# Altium schematic sheet NEO-M9N.SchDoc
size A4; SheetNumber: 6; SheetTotal: 10
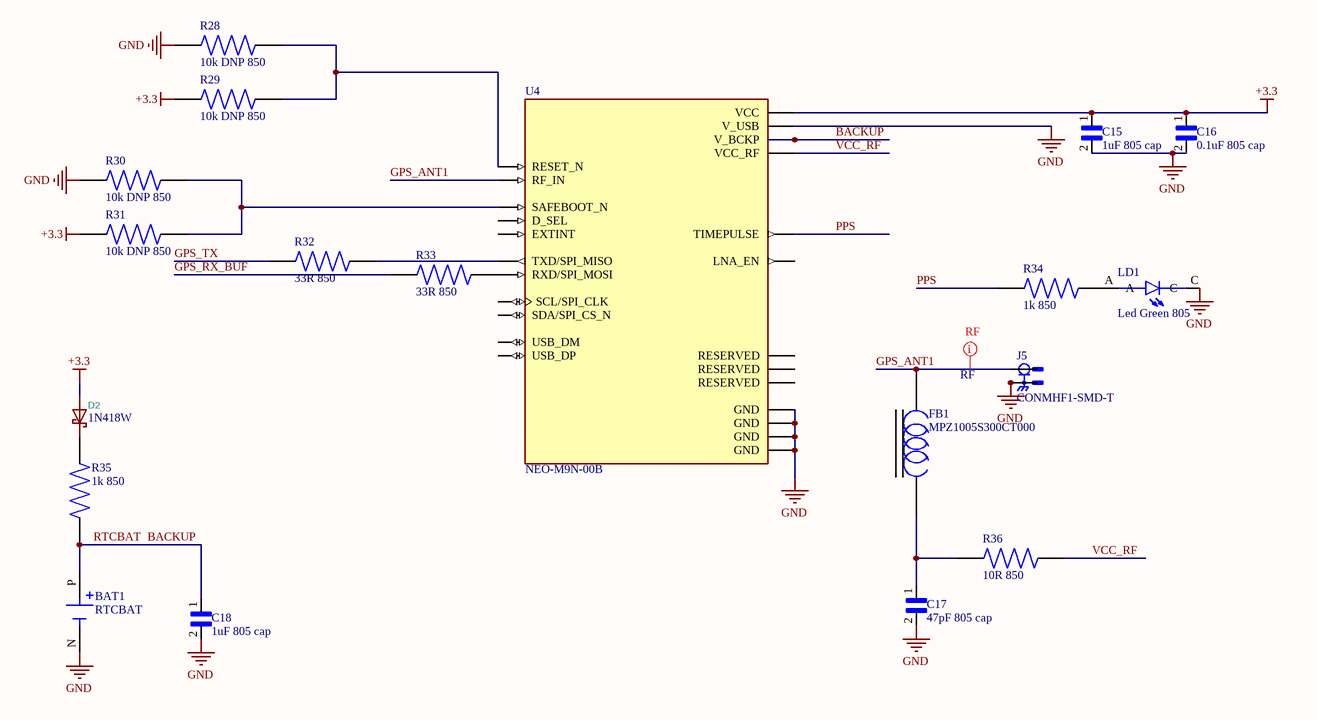
[diagram p0: NEO-M9N.SchDoc]

## Parts
BAT1  RTCBAT  [RTCBATTERY]
C15  1uF 805 cap  [1uF 805 Cap]
C16  0.1uF 805 cap  [1uF 805 Cap]
C17  47pF 805 cap  [1uF 805 Cap]
C18  1uF 805 cap  [1uF 805 Cap]
D2  1N418W  [SOD-523]
FB1  MPZ1005S300CT000  [BEADC1005X50N]
J5  CONMHF1-SMD-T  [TE_CONMHF1-SMD-T]
LD1  Led Green 805  [Led Green 805]
R28  10k DNP 850  [10k 850]
R29  10k DNP 850  [10k 850]
R30  10k DNP 850  [10k 850]
R31  10k DNP 850  [10k 850]
R32  33R 850  [10k 850]
R33  33R 850  [10k 850]
R34  1k 850  [10k 850]
R35  1k 850  [10k 850]
R36  10R 850  [10k 850]
U4  NEO-M9N-00B  [XCVR_NEO-M9N-00B]

## Nets
+3.3: C15.1 C16.1 D2.A R29.1 R31.1 U4.23(VCC)
GND: BAT1.N(NEG) C15.2 C16.2 C17.2 C18.2 J5.2(GND) J5.3(GND) J5.4(GND) LD1.C R28.1 R30.1 U4.7(V_USB) U4.10(GND) U4.12(GND) U4.13(GND) U4.24(GND)
BACKUP: BAT1.P(POS) C18.1 R35.2 U4.22(V_BCKP)  [also labelled RTCBAT]
GPS_ANT1: FB1.1 J5.1(SIG) U4.11(RF_IN)
GPS_RX_BUF: R33.1
GPS_TX: R32.1
PPS: R34.1 U4.3(TIMEPULSE)
VCC_RF: R36.2 U4.9(VCC_RF)
NetC17_1: C17.1 FB1.2 R36.1
NetD2_K: D2.K R35.1
NetLD1_A: LD1.A R34.2
NetR28_2: R28.2 R29.2 U4.8(RESET_N)
NetR30_2: R30.2 R31.2 U4.1(SAFEBOOT_N)
NetR32_2: R32.2 U4.20(TXD/SPI_MISO)
NetR33_2: R33.2 U4.21(RXD/SPI_MOSI)

Not connected (* = marked no-connect by the designer): U4 2(D_SEL) 4(EXTINT) 5(USB_DM) 6(USB_DP) 14(LNA_EN) 15(RESERVED) 16(RESERVED) 17(RESERVED) 18(SDA/SPI_CS_N) 19(SCL/SPI_CLK)

## Layout directives
net class RF: GPS_ANT1

## Library data of the parts
C16 C17 = 1uF 805 cap
D2 = 1N418W: ki_keywords: Schottky; ki_description: Schottky Diode; Datasheet: https://diotec.com/de/produktliste/SBD.html
R28-R36 = 10k 850
U4 = NEO-M9N-00B: series RF Receiver BeiDou, Galileo, GLONASS, GNSS, GPS - -167dBm - - Module; MF: u-blox; SnapEDA_Link: https://www.snapeda.com/parts/NEO-M9N-00B/u-blox/view-part/?ref=snap; Package: SMD-24 u-blox; Value: *; MP: NEO-M9N-00B; Check_prices: https://www.snapeda.com/parts/NEO-M9N-00B/u-blox/view-part/?ref=eda
J5 = CONMHF1-SMD-T: Package: None; Price: None; Value: *; MP: CONMHF1-SMD-T; Availability: Unavailable